# Altium schematic sheet BluetoothModule.SchDoc
size A4; SheetNumber: 5; SheetTotal: 5
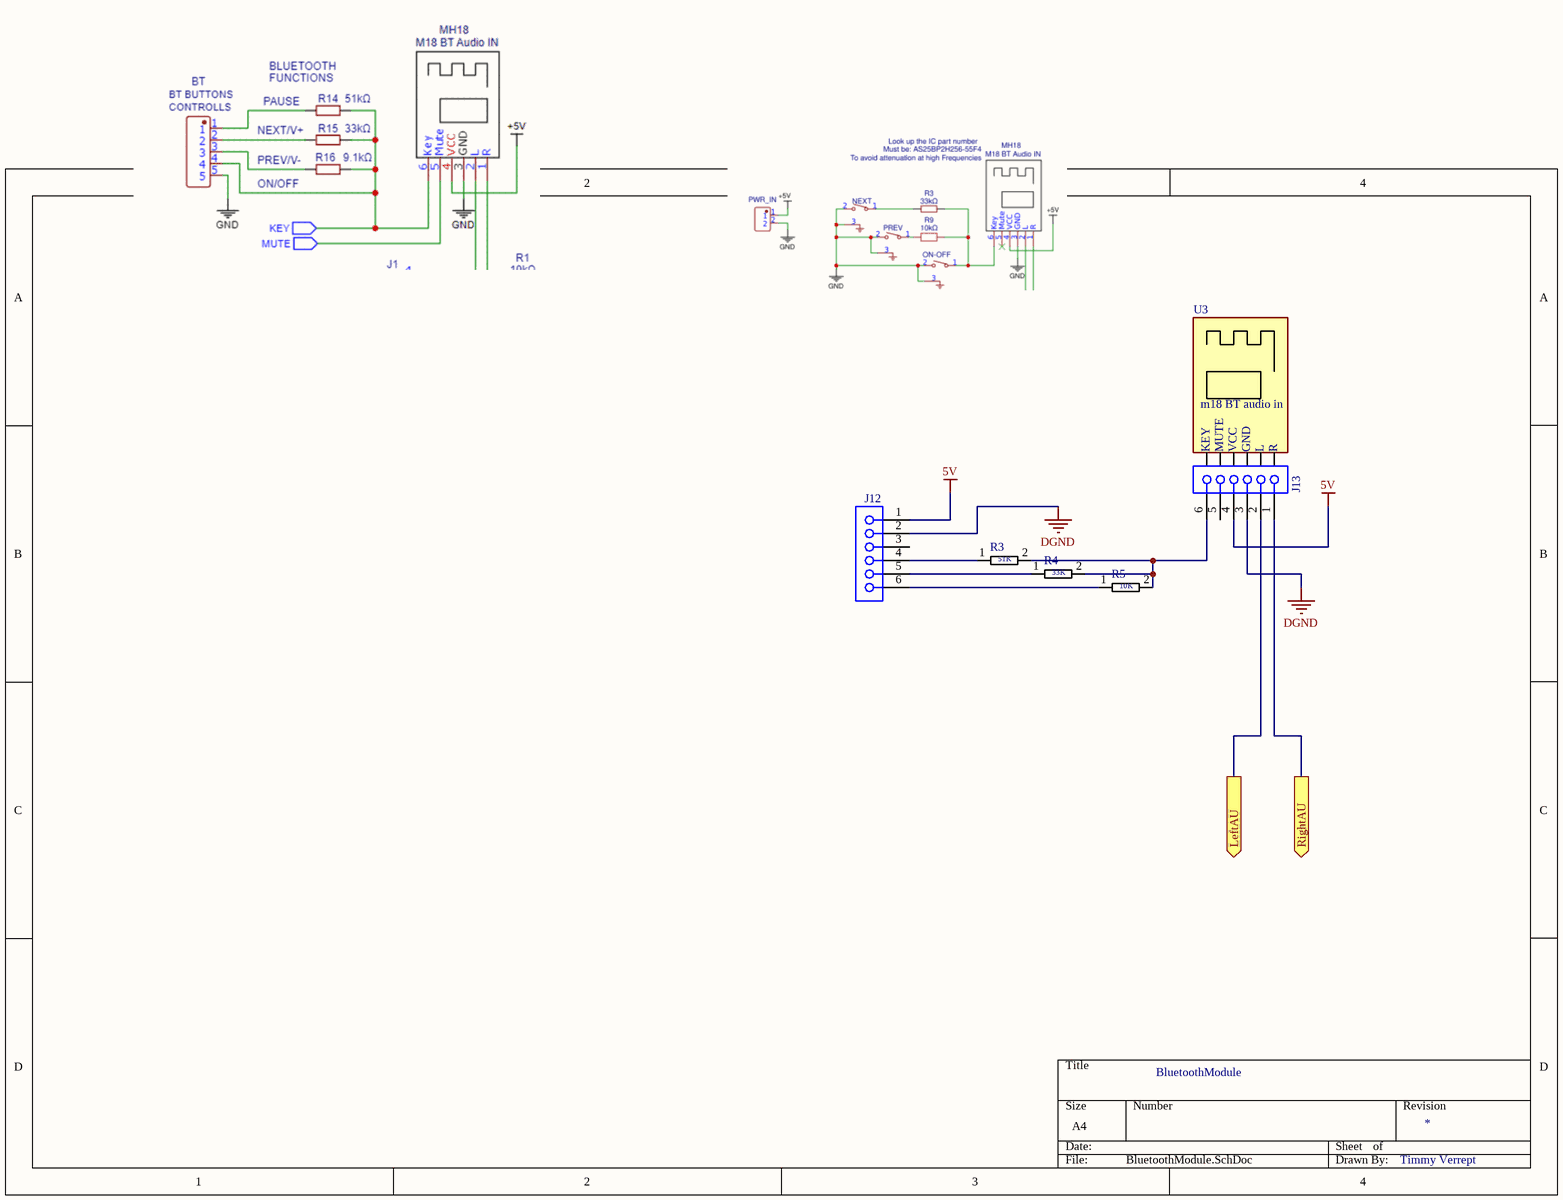
[diagram p0: BluetoothModule.SchDoc]

## Parts
J12  (no value)  [HEADER-6PINS]
J13  61300611821  [HEADER-6PINS]  (value not drawn)
R3  51K  [SMD_RESISTOR]
R4  33K  [SMD_RESISTOR]
R5  10K  [SMD_RESISTOR]
U3  m18 BT audio in  [ESP32_placeholder]

## Ports
LeftAU (out, see AudioFrontend[3A]), RightAU (out, see AudioFrontend[3A])

## Nets
5V: J12.1 J13.4
DGND: J12.2 J13.3
LeftAU: J13.2 ; port LeftAU
RightAU: J13.1 ; port RightAU
NetJ12_4: J12.4 R3.1
NetJ12_5: J12.5 R4.1
NetJ12_6: J12.6 R5.1
NetJ13_6: J13.6 R3.2 R4.2 R5.2

Not connected (* = marked no-connect by the designer): J12 3; J13 5

## Notes on the sheet
- BluetoothModule
- Timmy Verrept
- (in symbol Bluetooth Module) KEY; MUTE; VCC; GND; L; R

## Library data of the parts
J12 J13 = Header_female6P: THT Vertical Socket Header WR-PHD, Pitch 2.54 mm, Single Row, 6 pins; Current Rating: 3A; Contact Resistance: 20mΩ; Gender: Female; Operating Supply Voltage: 250V; RoHS: Compliant; Orientation: Vertical; Number of Pins: 6; Lead Pitch: 2.54mm
R3-R5 = Resistor: RES SMD 681 OHM 0.1% 1/8W 0805; Manufacturer: Yageo; Manufacturer Part Number: RT0805BRD07681RL; Value: 681Ω; Temperature Coefficient: 25 ppm/°C; Power Rating: 0.125W; Voltage Rating: 150V; Tolerance: 0.0025; ComponentLink2URL: http://www.yageo.com/documents/recent/PYu-RT_1-to-0.01_RoHS_L_9.pdf; Ipc Land Pattern Name: RESC200125X50; Footprint Url: http://www.yageo.com/exep/pages/download/literatures/PYu-R_Mount_10.pdf; Temperature: -55°C to +155°C; Resistance: 681Ω; Mouser Description: Thin Film Resistors - SMD 1/8W 681 ohm .1% 25ppm; Temperature Range High: +155°C; Device Class L3: Chip SMD Resistors; Automotive: No; Octopart: https://octopart.com/rt0805brd07681rl-yageo-1270194; Device Class L1: Passive Components; Package: RT0805; Device Class L2: Resistors; Category: Res; RoHS: TRUE; Composition: Thin Film; ComponentLink2Description: Datasheet; Temperature Range Low: -55°C; Lead Free: Yes; Digikey Description: RES SMD 681 OHM 0.1% 1/8W 0805; Height: 0.6mm; Series: RT
U3 = Bluetooth Module